# EAGLE design whare hauora sensor r1 (EAGLE 7.6.0)
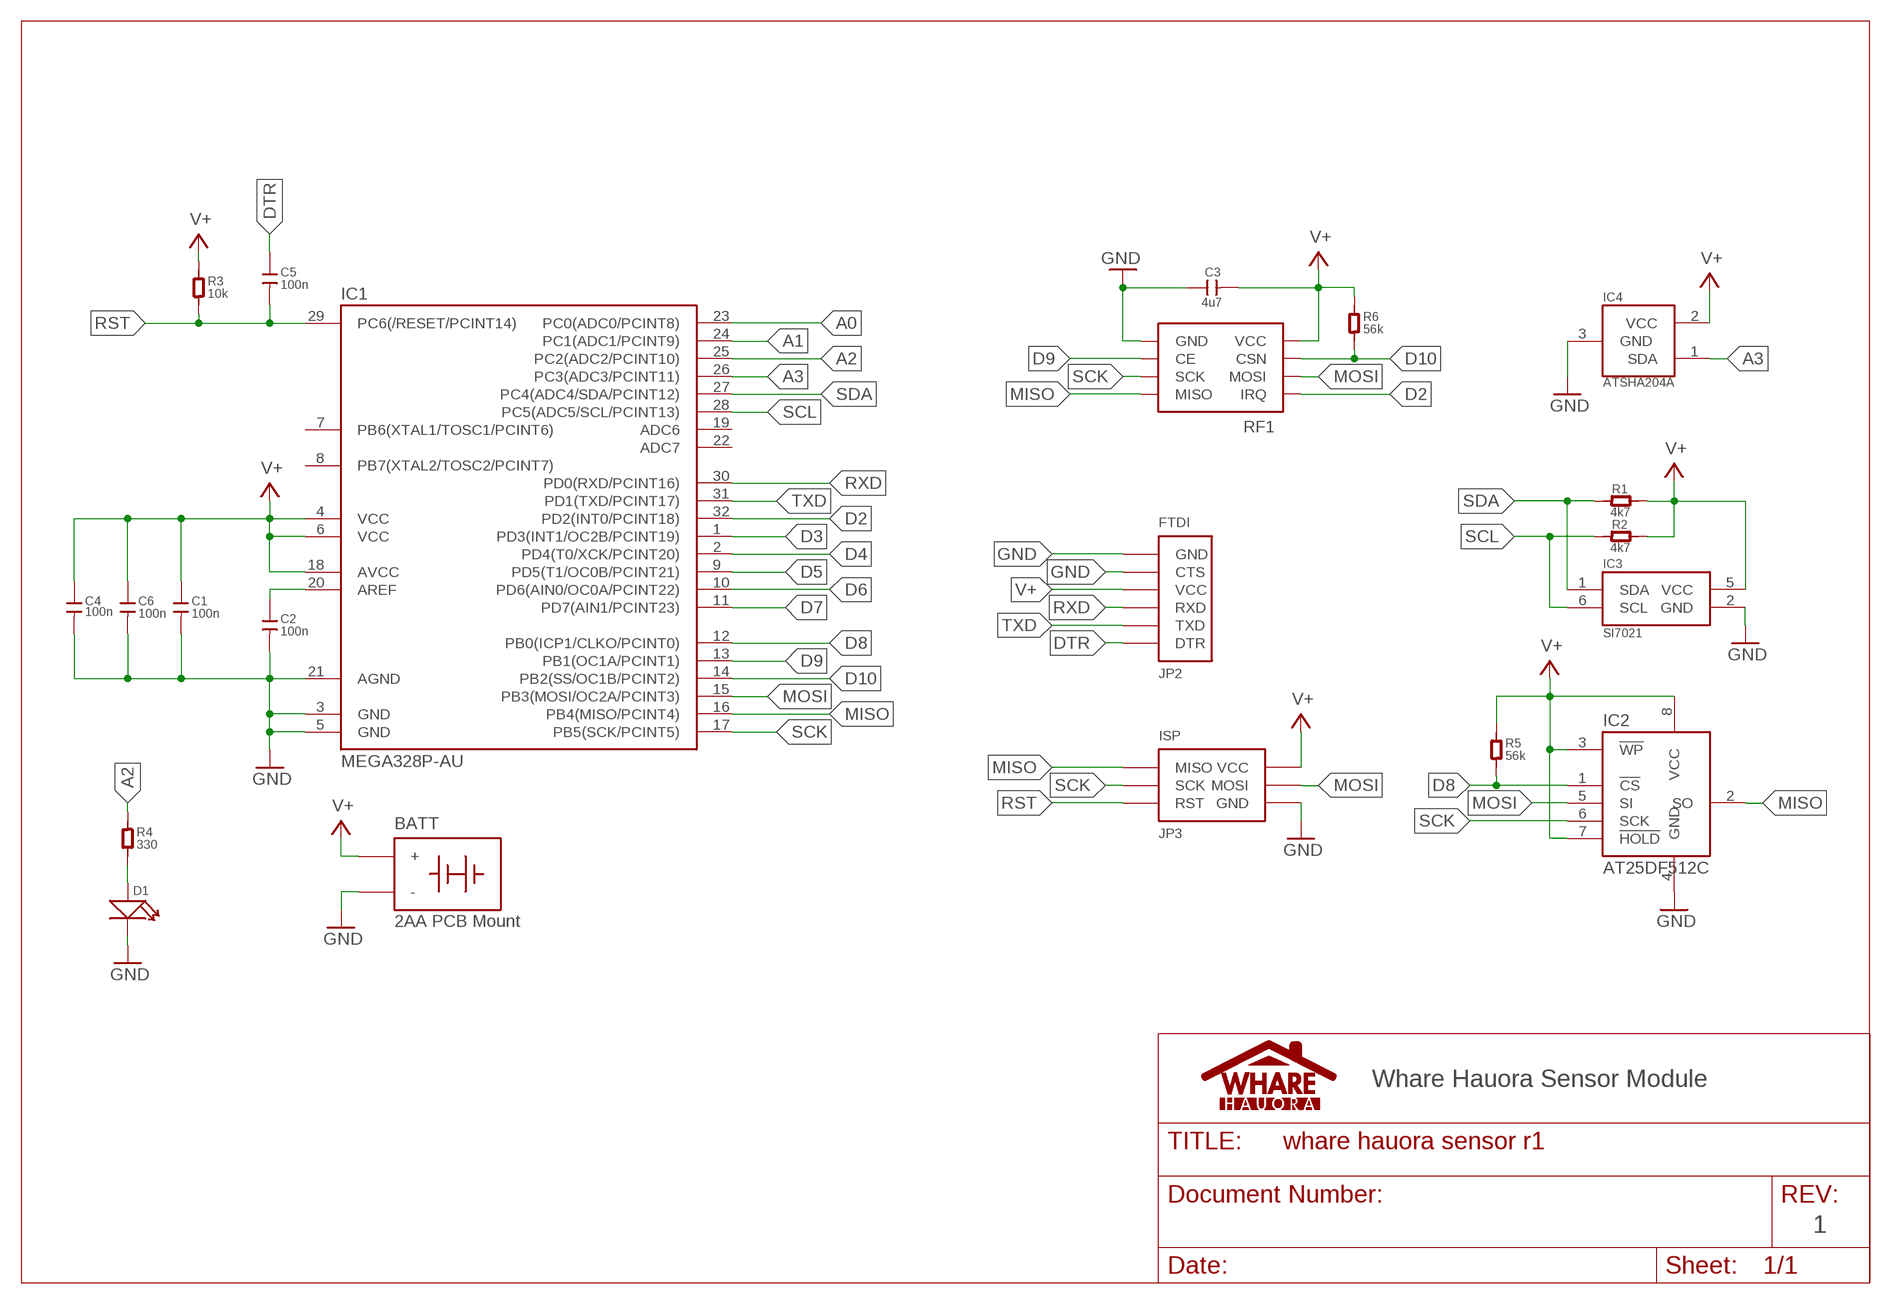
[diagram p0: schematic, sheet 1]

## Parts
BATT  2AA-PACK  [2AA-PACK\]
C1  100n  CAP-0603  [C0603]
C2  100n  CAP-0603  [C0603]
C3  4u7  CAP-0603  [C0603]
C4  100n  CAP-0603  [C0603]
C5  100n  CAP-0603  [C0603]
C6  100n  CAP-0603  [C0603]
D1  LED-0603  [LED-0603]
IC1  MEGA328P-AU  MEGA48/88/168-AU  [TQFP32-08]
IC2  AT25DF512C  [SO8]
IC3  SI7021  [DFN6]
IC4  ATSHA204A  [SOT23]
JP2  FTDI  [FTDI]
JP3  ISP  [ISP]
R1  4k7  R-0603  [R0603]
R2  4k7  R-0603  [R0603]
R3  10k  R-0603  [R0603]
R4  330  R-0603  [R0603]
R5  56k  R-0603  [R0603]
R6  56k  R-0603  [R0603]
RF1  NRF24L01+  [NRF24L01+]

## Nets
A0: IC1.23(PC0(ADC0/PCINT8))
A1: IC1.24(PC1(ADC1/PCINT9))
A2: IC1.25(PC2(ADC2/PCINT10)) R4.1
A3: IC1.26(PC3(ADC3/PCINT11)) IC4.1(SDA)
D2: IC1.32(PD2(INT0/PCINT18)) RF1.P$8(IRQ)
D3: IC1.1(PD3(INT1/OC2B/PCINT19))
D4: IC1.2(PD4(T0/XCK/PCINT20))
D5: IC1.9(PD5(T1/OC0B/PCINT21))
D6: IC1.10(PD6(AIN0/OC0A/PCINT22))
D7: IC1.11(PD7(AIN1/PCINT23))
D8: IC1.12(PB0(ICP1/CLKO/PCINT0)) IC2.1(!CS) R5.1
D9: IC1.13(PB1(OC1A/PCINT1)) RF1.P$3(CE)
D10: IC1.14(PB2(SS/OC1B/PCINT2)) R6.1 RF1.P$4(CSN)
DTR: C5.1 JP2.DTR
GND [Power]: BATT.- C1.2 C2.2 C3.1 C4.2 C6.2 D1.- IC1.3(GND) IC1.5(GND) IC1.21(AGND) IC2.4(GND) IC3.2(GND) IC4.3(GND) JP2.CTS JP2.GND JP3.GND RF1.P$1(GND)
MISO: IC1.16(PB4(MISO/PCINT4)) IC2.2(SO) JP3.MISO RF1.P$7(MISO)
MOSI: IC1.15(PB3(MOSI/OC2A/PCINT3)) IC2.5(SI) JP3.MOSI RF1.P$6(MOSI)
N$3: D1.+ R4.2
N$4: C2.1 IC1.20(AREF)
RST: C5.2 IC1.29(PC6(/RESET/PCINT14)) JP3.RST R3.1
RXD: IC1.30(PD0(RXD/PCINT16)) JP2.RXD
SCK: IC1.17(PB5(SCK/PCINT5)) IC2.6(SCK) JP3.SCK RF1.P$5(SCK)
SCL: IC1.28(PC5(ADC5/SCL/PCINT13)) IC3.6(SCL) R2.1
SDA: IC1.27(PC4(ADC4/SDA/PCINT12)) IC3.1(SDA) R1.1
TXD: IC1.31(PD1(TXD/PCINT17)) JP2.TXD
V+ [Power]: BATT.+ C1.1 C3.2 C4.1 C6.1 IC1.4(VCC) IC1.6(VCC) IC1.18(AVCC) IC2.3(!WP) IC2.7(!HOLD) IC2.8(VCC) IC3.5(VCC) IC4.2(VCC) JP2.VCC JP3.VCC R1.2 R2.2 R3.2 R5.2 R6.2 RF1.P$2(VCC)
Unconnected: IC1.7(PB6(XTAL1/TOSC1/PCINT6)) IC1.8(PB7(XTAL2/TOSC2/PCINT7)) IC1.19(ADC6) IC1.22(ADC7)

## Notes on the sheet
- Whare Hauora Sensor Module
- 1

## Library data of the parts
BATT = Callum:2AA-PACK: PCB mount dual AA battery holder RS# 611-9598
C1-C6 = Discrete:CAP: Ceramic Capacitors
D1 = Discrete:LED
IC1 = avr-7:MEGA48/88/168
IC2 = Callum:AT25DF512C
IC3 = Sensor:SI7021
IC4 = Sensor:ATSHA204A
JP2 = Callum:FTDI: FTDI Programming Header
JP3 = Callum:ISP
R1-R6 = Discrete:R*
RF1 = Callum:NRF24L01+

## Net classes
0 default: width 0.203 mm
1 Power: width 0.406 mm

## Board
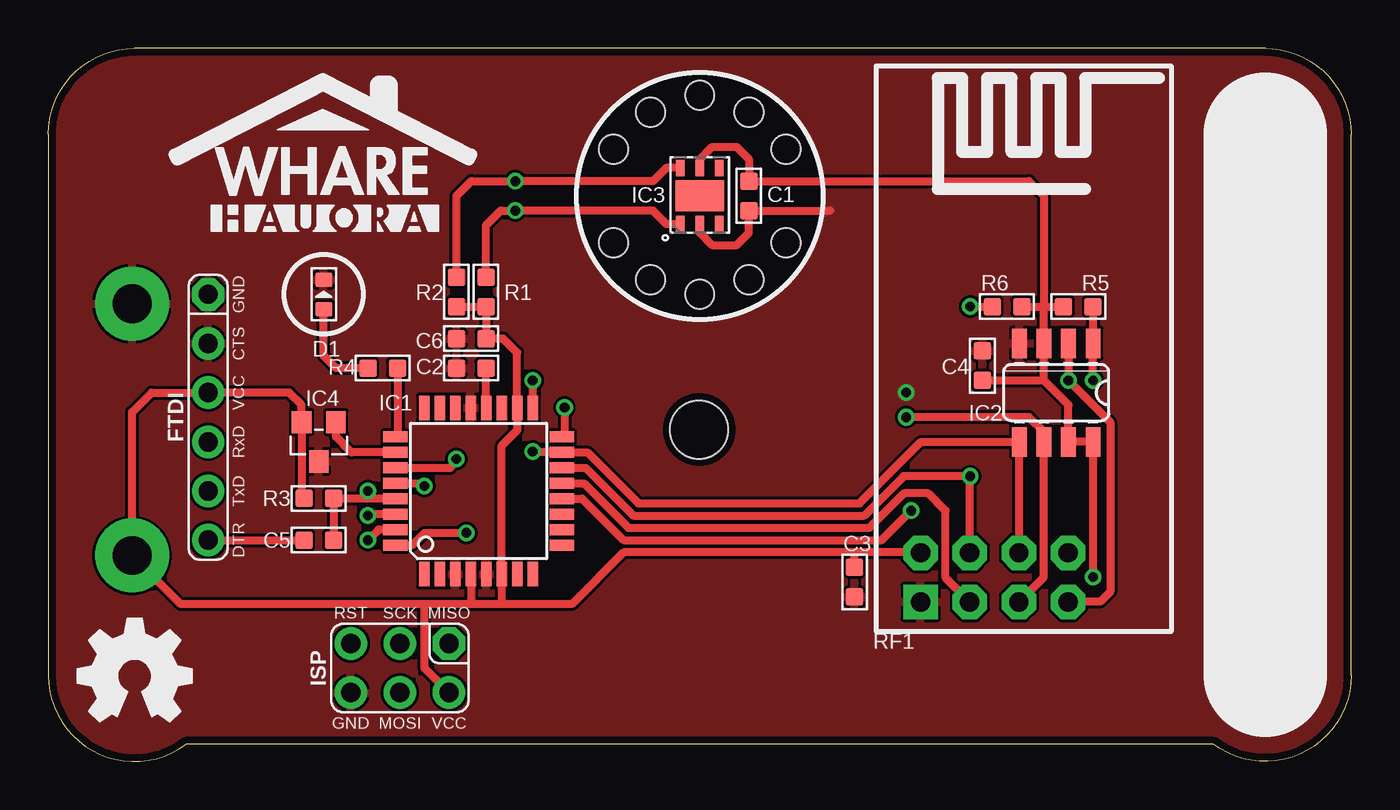
[diagram p1: board, top side]
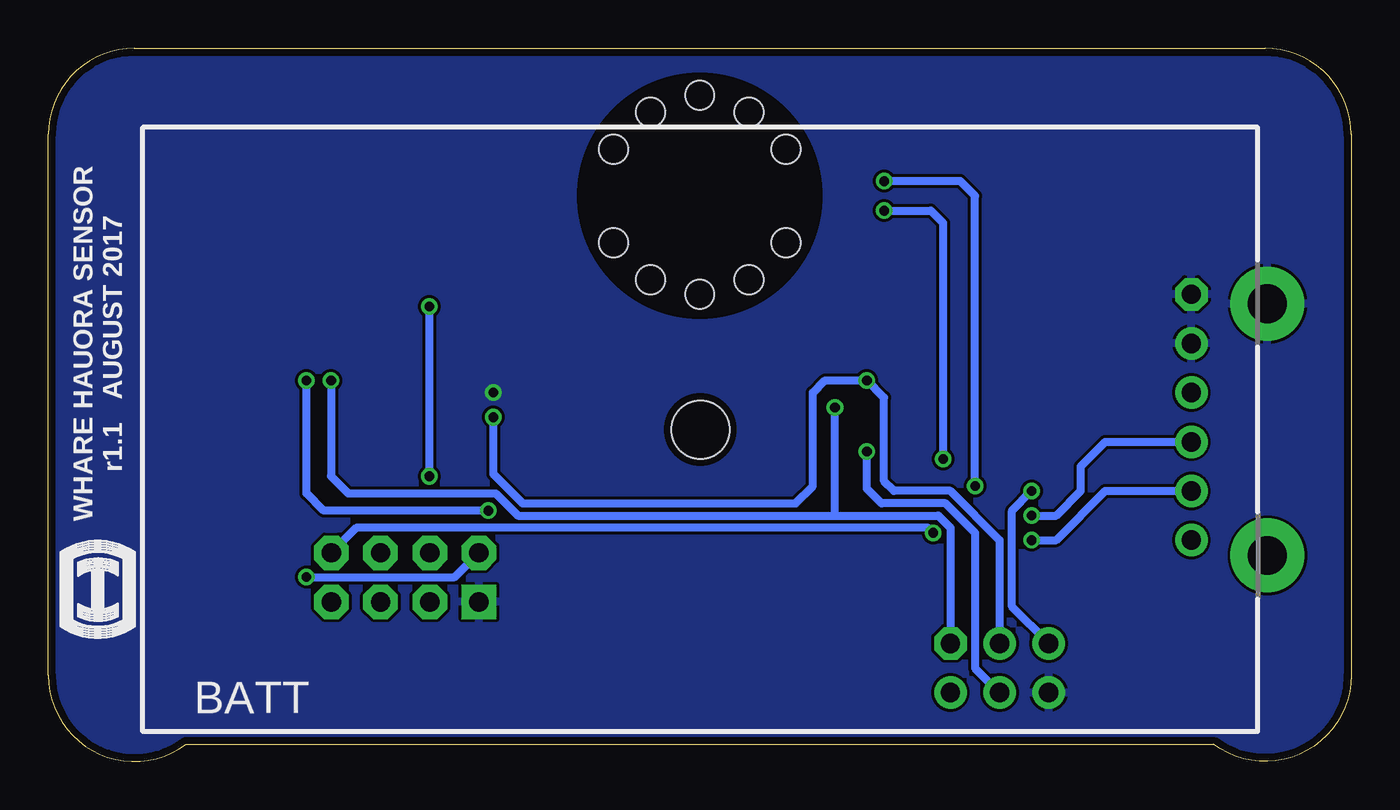
[diagram p2: board, bottom side, seen from below]

Size 67.31 x 36.83 mm. Coordinates in mm from the lower left corner, seen from the top.
Outline: 67.31,4.44 67.31,32.38 arc90 62.87,36.83 4.45,36.83 arc90 0,32.38 0,4.44 arc127 7.11,0.89 60.2,0.89 arc127 67.31,4.44
Copper layers (1*16): Top 0.0356mm / dielectric 1.5011mm / Bottom 0.0356mm
Design rules "OSHpark DRC": minimum track width 6mil, minimum drill 13mil, track to track 6mil, track to pad 6mil, pad to pad 6mil, via to via 6mil, smd to smd 6mil, copper to edge 15mil, drill to drill 6mil, minimum pad ring 7mil, minimum via ring 7mil, stop-mask expansion 3mil, vias tented up to drill 30mil, thermal gap 6mil
Holes 1.5 mm at 29.21,31.62 38.1,31.62 33.66,34.41 31.11,33.53 36.2,33.53 33.66,24.13 38.1,26.79 29.21,26.79 31.11,24.89 36.2,24.89
tRestrict: area 27.3,22.9 to 40,35.6
bRestrict: area 27.3,22.9 to 40,35.6

### Footprints (pad centres in the part's own frame; a part is rotated, then mirrored left to right if it is on the bottom)
2AA-PACK\ = drill 2 pad 3.81: + -0.5,6.5; - -0.5,-6.5 | hole 3: 28.8,0
C0603 = smd 0.889 x 0.889: 1 -0.762,0; 2 0.762,0
LED-0603 = smd 0.762 x 0.889: + -0.762,0; - 0.762,0
TQFP32-08 = smd 1.27 x 0.559: 1 -4.293,2.8; 2 -4.293,2; 3 -4.293,1.2; 4 -4.293,0.4; 5 -4.293,-0.4; 6 -4.293,-1.2; 7 -4.293,-2; 8 -4.293,-2.8; 17 4.293,-2.8; 18 4.293,-2; 19 4.293,-1.2; 20 4.293,-0.4; 21 4.293,0.4; 22 4.293,1.2; 23 4.293,2; 24 4.293,2.8 | smd 0.559 x 1.27: 9 -2.8,-4.293; 10 -2,-4.293; 11 -1.2,-4.293; 12 -0.4,-4.293; 13 0.4,-4.293; 14 1.2,-4.293; 15 2,-4.293; 16 2.8,-4.293; 25 2.8,4.293; 26 2,4.293; 27 1.2,4.293; 28 0.4,4.293; 29 -0.4,4.293; 30 -1.2,4.293; 31 -2,4.293; 32 -2.8,4.293
SO8 = smd 1.524 x 0.762: 1 -2.54,1.905; 2 -2.54,0.635; 3 -2.54,-0.635; 4 -2.54,-1.905; 5 2.54,-1.905; 6 2.54,-0.635; 7 2.54,0.635; 8 2.54,1.905
DFN6 = smd 0.85 x 0.45: 1 -1.45,1; 2 -1.45,0; 3 -1.45,-1; 4 1.45,-1; 5 1.45,0; 6 1.45,1 | smd 1.6 x 2.5: P$1 0,0
SOT23 = smd 1.016 x 1.143: 1 -0.889,-1.016; 2 0.889,-1.016; 3 0,1.016
FTDI = drill 1 pad 1.676: CTS 2.54,0; DTR 12.7,0; RXD 7.62,0; TXD 10.16,0; VCC 5.08,0 | drill 1 pad 1.676 octagon: GND 0,0
ISP = drill 1 pad 1.676: GND 2.54,-5.08; MOSI 2.54,-2.54; RST 0,-5.08; SCK 0,-2.54; VCC 2.54,0 | drill 1 pad 1.676 octagon: MISO 0,0
R0603 = smd 0.889 x 0.889: 1 0,0.762; 2 0,-0.762
NRF24L01+ = drill 1 pad 1.778 square: P$1 0,0 | drill 1 pad 1.778 octagon: P$2 -2.54,0; P$3 0,2.54; P$4 -2.54,2.54; P$5 0,5.08; P$6 -2.54,5.08; P$7 0,7.62; P$8 -2.54,7.62

### Placement (x,y rotation side)
BATT  4.83,17.14 180 bottom
C1  36.2,29.21 270 top
C2  21.84,20.32 180 top
C3  41.66,9.27 90 top
C4  48.26,20.44 90 top
C5  13.97,11.43 0 top
C6  21.84,21.84 180 top
D1  14.22,24.13 90 top
IC1  22.23,13.97 90 top
IC2  52.07,19.05 270 top
IC3  33.66,29.21 90 top
IC4  13.97,16.51 180 top
JP2  8.26,24.13 270 top
JP3  20.7,6.09 270 top
R1  22.61,24.25 0 top
R2  21.08,24.25 0 top
R3  13.97,13.59 270 top
R4  17.27,20.32 270 top
R5  53.21,23.49 270 top
R6  49.53,23.49 90 top
RF1  45.07,8.24 270 top
U$1  [OSHW-LOGO]  4.45,4.44 0 top
U$2  [WHAREHAUORA-SMALL]  14.35,31.37 0 top
U$4  [MY-LOGO-SMALL]  64.77,8.89 90 bottom

### Tracks (layer width: path | path; a pad name or v marks a point on that pad's centre or on a via)
A2
  Top 0.406: R4.1 18.03,16.87 IC1.25
A3
  Top 0.406: IC1.26 15.65,15.97 14.86,16.76 IC4.1
D2  (via drill 0.5)
  Top 0.406: IC1.32 18.79,11.17 19.43,11.81 v21.59,11.81
  Bottom 0.406: v21.59,11.81 21.84,12.06 51.4,12.06 RF1.P$8
D8  (via drill 0.5)
  Top 0.406: IC1.12 27.58,13.57 29.72,11.43 43.05,11.43 v44.58,12.95 | v53.98,19.68 IC2.1 R5.1
  Bottom 0.406: v44.58,12.95 53.09,12.95 53.98,13.84 v53.98,19.68
D9
  Top 0.406: RF1.P$3 46.35,9.49 46.35,12.95 45.47,13.84 44.2,13.84 42.42,12.06 29.97,12.06 27.67,14.37 IC1.13
D10  (via drill 0.5)
  Top 0.406: IC1.14 27.76,15.17 30.23,12.7 42.16,12.7 44.2,14.73 v47.62,14.73 47.62,10.78 RF1.P$4 | v47.62,23.49 R6.1
  Bottom 0.406: v47.62,14.73 v47.62,23.49
DTR
  Top 0.406: JP2.DTR C5.1
GND  (via drill 0.5)
  Top 0.406: IC3.2 33.66,27.3 34.29,26.67 35.56,26.67 36.2,27.3 C1.2 40.39,28.45
  other vias: 44.32,19.05
  pour Top: 0,0 67.31,0 67.31,36.83 0,36.83
  pour Bottom: 0,36.83 67.31,36.83 67.31,0 0,0
MISO  (via drill 0.5)
  Top 0.406: v26.67,18.29 26.67,16.87 IC1.16 | IC2.2 v52.7,19.68 54.86,17.52 54.86,8.76 54.36,8.25 52.7,8.25 RF1.P$7
  Bottom 0.406: v52.7,19.68 52.7,14.73 51.82,13.84 44.2,13.84 43.05,12.7 26.67,12.7 | 26.67,12.7 v26.67,18.29 | 26.67,12.7 21.34,12.7 20.7,12.06 JP3.MISO
MOSI  (via drill 0.5)
  Top 0.406: v25.02,16 25.05,15.97 IC1.15 27.84,15.97 30.48,13.33 41.91,13.33 45.09,16.51 IC2.5 50.16,10.78 RF1.P$6
  Bottom 0.406: v25.02,16 25.02,14.09 24.26,13.33 20.95,13.33 19.43,11.81 19.43,4.82 JP3.MOSI
N$3
  Top 0.406: R4.2 14.86,20.32 14.22,20.95 D1.+
N$4
  Top 0.406: IC1.20 22.61,18.28 C2.1
RST  (via drill 0.5)
  Top 0.406: C5.2 R3.1 16.51,13.59 | 16.51,13.59 17.91,13.59 IC1.29 | v16.51,13.97 16.51,13.59
  Bottom 0.406: JP3.RST 17.53,8 17.53,12.95 v16.51,13.97
RXD  (via drill 0.5)
  Top 0.406: IC1.30 16.58,12.77 v16.51,12.7
  Bottom 0.406: v16.51,12.7 15.24,12.7 13.97,13.97 13.97,15.24 12.7,16.51 JP2.RXD
SCK  (via drill 0.5)
  Top 0.406: v25.02,19.68 25.02,18.27 IC1.17 | RF1.P$5 51.44,9.52 IC2.6 51.44,17.02 50.67,17.78 v44.32,17.78
  Bottom 0.406: v44.32,17.78 44.32,14.86 42.8,13.33 28.7,13.33 27.81,14.22 27.81,19.05 27.18,19.68 v25.02,19.68 24.13,18.79 24.13,14.48 23.62,13.97 20.7,13.97 18.16,11.43 JP3.SCK
SCL  (via drill 0.5)
  Top 0.406: IC3.6 31.93,30.66 31.24,29.97 v24.13,29.97 21.84,29.97 21.08,29.21 R2.1 | IC1.28 19.29,14.37 v19.43,14.22
  Bottom 0.406: v19.43,14.22 19.43,29.21 20.19,29.97 v24.13,29.97
SDA  (via drill 0.5)
  Top 0.406: IC3.1 31.93,27.76 31.24,28.45 v24.13,28.45 23.37,28.45 22.61,27.68 R1.1 | IC1.27 20.76,15.17 21.08,15.49 v21.08,15.62
  Bottom 0.406: v24.13,28.45 21.72,28.45 21.08,27.81 v21.08,15.62
TXD  (via drill 0.5)
  Top 0.406: IC1.31 17.05,11.97 v16.51,11.43
  Bottom 0.406: v16.51,11.43 15.24,11.43 12.7,13.97 JP2.TXD
V+  (via drill 0.5)
  Top 0.406: R3.2 13.08,13.59 IC4.2 13.08,18.41 12.45,19.05 JP2.VCC 5.33,19.05 4.33,18.04 BATT.+ 6.84,8.13 19.43,8.13 | 23.37,8.13 27.05,8.13 29.72,10.79 41.66,10.79 | 23.37,8.13 21.84,8.13 | 41.66,10.79 45.05,10.79 RF1.P$2 | 21.84,8.13 19.43,8.13 | IC1.4 21.84,9.67 21.84,8.13 | v53.98,9.52 IC2.8 IC2.7 52.7,18.41 51.44,19.68 | 51.44,19.68 IC2.3 51.44,23.49 | C4.1 51.44,19.68 | R6.2 51.44,23.49 | 51.44,23.49 R5.2 | 23.37,8.13 23.43,8.18 IC1.6 23.43,16.31 24.23,17.11 IC1.18 24.23,21.11 23.5,21.84 C6.1 R1.2 R2.2 | IC3.5 33.66,31.11 34.29,31.75 35.56,31.75 36.2,31.11 C1.1 50.67,29.97 51.44,29.21 51.44,23.49 | JP3.VCC 19.43,4.82 19.43,8.13 | C3.2 41.66,10.79
  Bottom 0.406: v53.98,9.52 46.32,9.52 RF1.P$2

### Text on the board
bPlace: r1.1 AUGUST 2017 | WHARE HAUORA SENSOR
tDocu: COMPONENT REFERENCE | SI7021 | 0.1u | 4k7 | 4k7 | 56k | 56k | 0.1u | 330 | 0.1u | 0.1u | ATSHA204A | 10k | MEGA328P | 0.1u | 4u7